# EAGLE design Test (EAGLE 9.2.2)
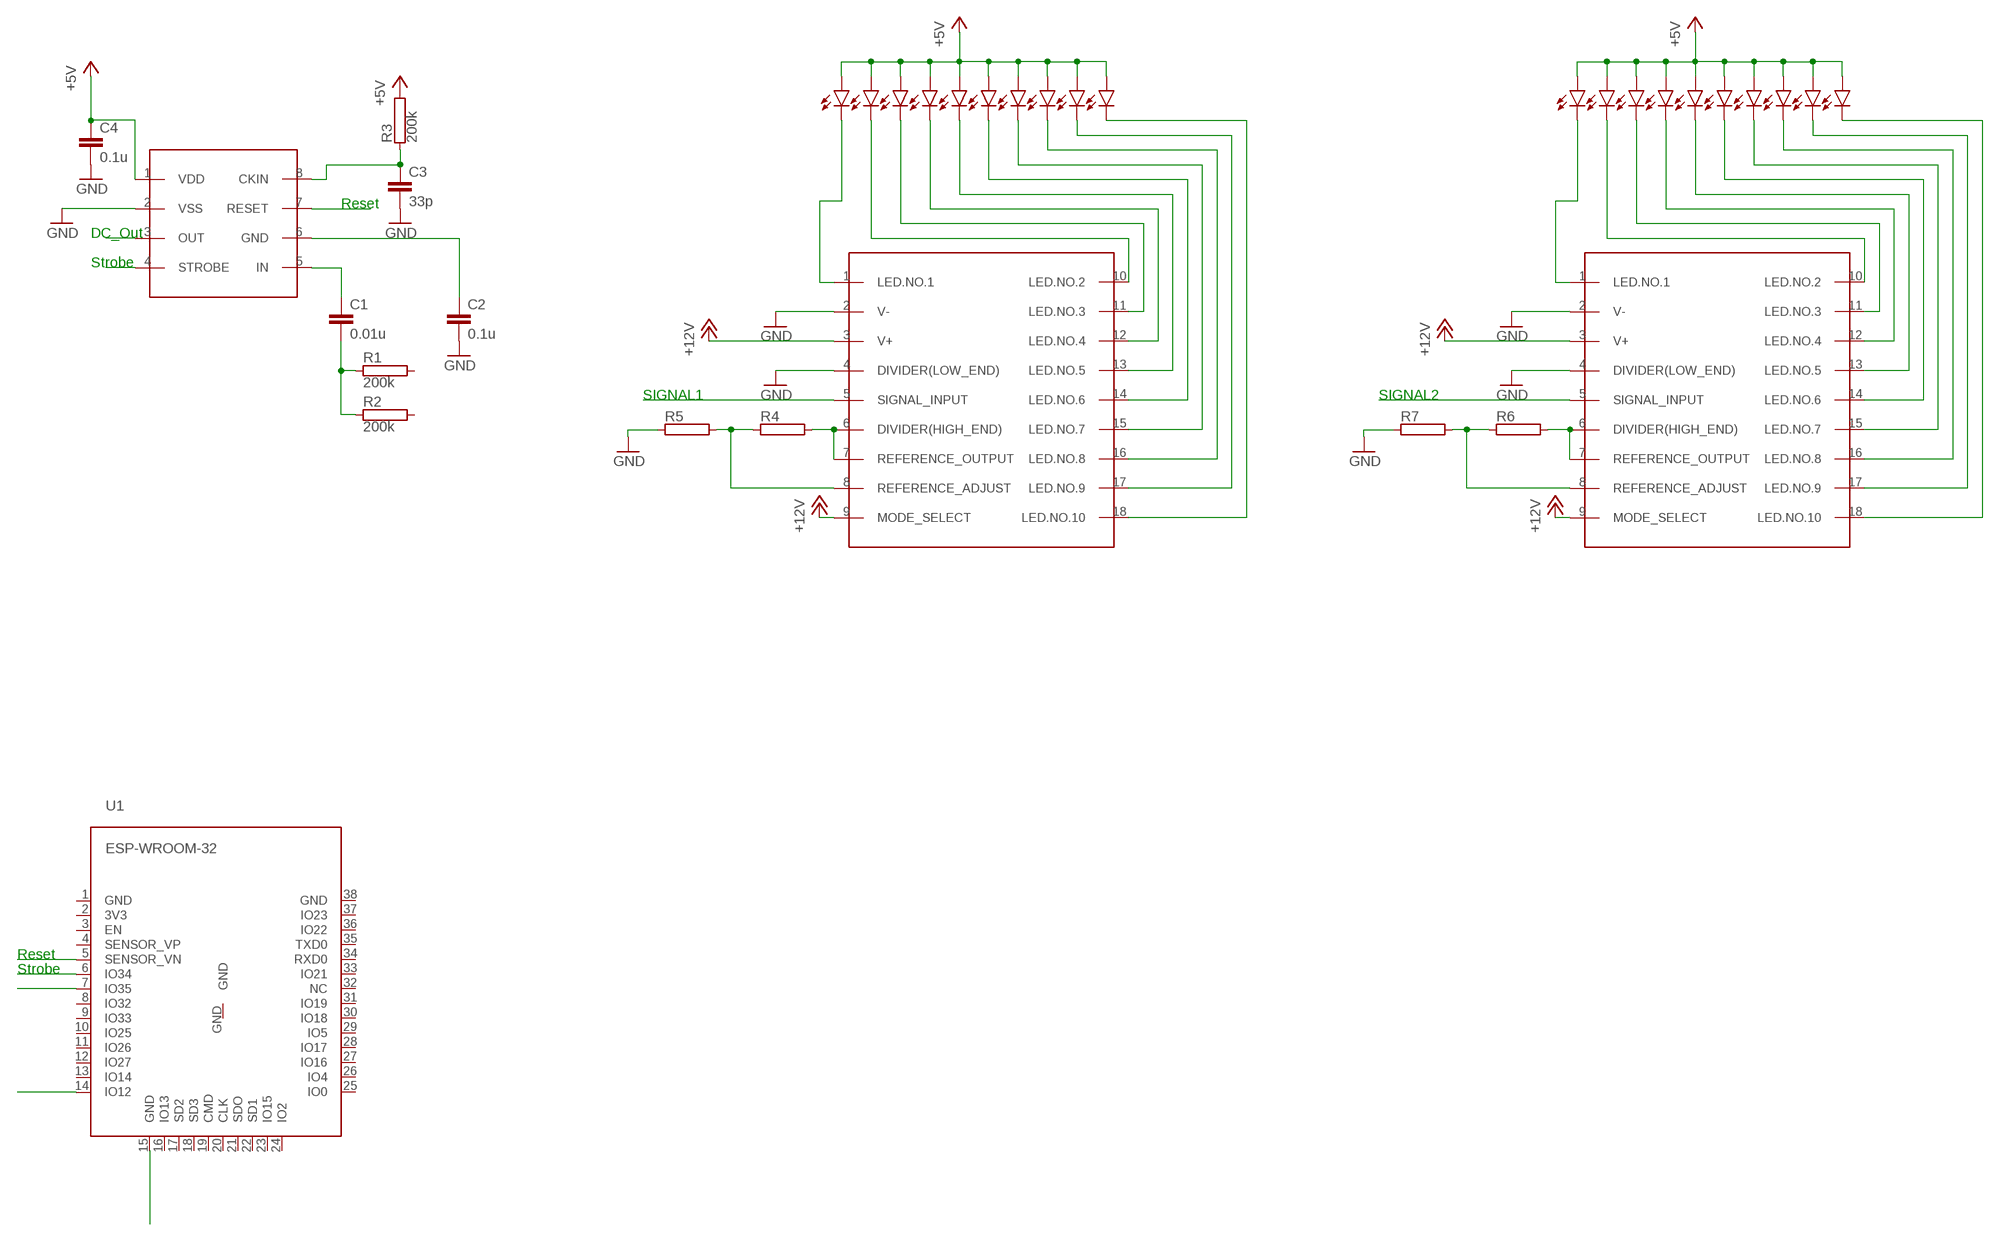
[diagram p0: schematic, sheet 1]

## Parts
C1  0.01u  C2.5/2  [C2.5-2]
C2  0.1u  C2.5/2  [C2.5-2]
C3  33p  C2.5/2  [C2.5-2]
C4  0.1u  C2.5/2  [C2.5-2]
R1  200k  RAC01  [AC01]
R2  200k  RAC01  [AC01]
R3  200k  RAC01  [AC01]
R4  RAC01  [AC01]
R5  RAC01  [AC01]
R6  RAC01  [AC01]
R7  RAC01  [AC01]
U1  ESP-WROOM-32  [ESP-WROOM-32]
U$1  MSGEQ7  [DIL08]
U$2  LB10  [LB10]
U$3  LM3914  [DIL18]
U$4  LB10  [LB10]
U$5  LM3914  [DIL18]

## Nets
+5V: C4.1 R3.2 U$1.1(VDD) U$2.1(A) U$2.2(A1) U$2.3(A2) U$2.4(A3) U$2.5(A4) U$2.6(A5) U$2.7(A6) U$2.8(A7) U$2.9(A8) U$2.10(A9) U$4.1(A) U$4.2(A1) U$4.3(A2) U$4.4(A3) U$4.5(A4) U$4.6(A5) U$4.7(A6) U$4.8(A7) U$4.9(A8) U$4.10(A9)
+12V: U$3.3(V+) U$3.9(MODE_SELECT) U$5.3(V+) U$5.9(MODE_SELECT)
GND: C2.2 C3.2 C4.2 R5.1 R7.1 U$1.2(VSS) U$3.2(V-) U$3.4(DIVIDER(LOW_END)) U$5.2(V-) U$5.4(DIVIDER(LOW_END))
N$1: C2.1 U$1.6(GND)
N$2: C3.1 R3.1 U$1.8(CKIN)
N$3: C1.2 R1.1 R2.1
N$4: C1.1 U$1.5(IN)
N$5: U$1.3(OUT)
N$7: U$1.4(STROBE)
N$8: U$1.7(RESET)
N$9: U$2.11(C) U$3.1(LED.NO.1)
N$10: U$2.12(C1) U$3.10(LED.NO.2)
N$11: U$2.13(C2) U$3.11(LED.NO.3)
N$12: U$2.14(C3) U$3.12(LED.NO.4)
N$13: U$2.15(C4) U$3.13(LED.NO.5)
N$14: U$2.16(C5) U$3.14(LED.NO.6)
N$15: U$2.17(C6) U$3.15(LED.NO.7)
N$16: U$2.18(C7) U$3.16(LED.NO.8)
N$17: U$2.19(C8) U$3.17(LED.NO.9)
N$18: U$2.20(C9) U$3.18(LED.NO.10)
N$19: R4.1 R5.2 U$3.8(REFERENCE_ADJUST)
N$20: U$4.11(C) U$5.1(LED.NO.1)
N$21: U$3.5(SIGNAL_INPUT)
N$22: R4.2 U$3.6(DIVIDER(HIGH_END)) U$3.7(REFERENCE_OUTPUT)
N$23: U$4.12(C1) U$5.10(LED.NO.2)
N$24: U$4.13(C2) U$5.11(LED.NO.3)
N$25: U$4.14(C3) U$5.12(LED.NO.4)
N$26: U$4.15(C4) U$5.13(LED.NO.5)
N$27: U$4.16(C5) U$5.14(LED.NO.6)
N$28: U$4.17(C6) U$5.15(LED.NO.7)
N$29: U$4.18(C7) U$5.16(LED.NO.8)
N$30: U$4.19(C8) U$5.17(LED.NO.9)
N$31: U$4.20(C9) U$5.18(LED.NO.10)
N$32: U$5.5(SIGNAL_INPUT)
N$33: R6.2 U$5.6(DIVIDER(HIGH_END)) U$5.7(REFERENCE_OUTPUT)
N$34: R6.1 R7.2 U$5.8(REFERENCE_ADJUST)
N$35: U1.5(SENSOR_VN)
N$36: U1.6(IO34)
N$37: U1.7(IO35)
N$38: U1.14(IO12)
N$39: U1.15(GND)
Unconnected: R1.2 R2.2 U1.1(GND) U1.2(3V3) U1.3(EN) U1.4(SENSOR_VP) U1.8(IO32) U1.9(IO33) U1.10(IO25) U1.11(IO26) U1.12(IO27) U1.13(IO14) U1.16(IO13) U1.17(SD2) U1.18(SD3) U1.19(CMD) U1.20(CLK) U1.21(SDO) U1.22(SD1) U1.23(IO15) U1.24(IO2) U1.25(IO0) U1.26(IO4) U1.27(IO16) U1.28(IO17) U1.29(IO5) U1.30(IO18) U1.31(IO19) U1.32(NC) U1.33(IO21) U1.34(RXD0) U1.35(TXD0) U1.36(IO22) U1.37(IO23) U1.38(GND) U1.GND

## Notes on the sheet
- Reset
- DC_Out
- Strobe
- SIGNAL1 | SIGNAL2
- Reset
- Strobe

## Library data of the parts
C1-C4 = capacitor-wima:C: CAPACITOR naming: grid - package width
R1-R7 = resistor-power:R: Power Resitor; OC_FARNELL: unknown; OC_NEWARK: unknown
U1 = SpectralAnalyzer:ESP-WROOM-32
U$1 = SpectralAnalyzer:MSGEQ7: Seven Band Graphic Equalizer
U$2 U$4 = SpectralAnalyzer:LB10: Bar LED
U$3 U$5 = SpectralAnalyzer:LM3914: Dot/Bar Display Driver

## Net classes
0 default: width 1.27 mm, clearance 0.381 mm

## Board
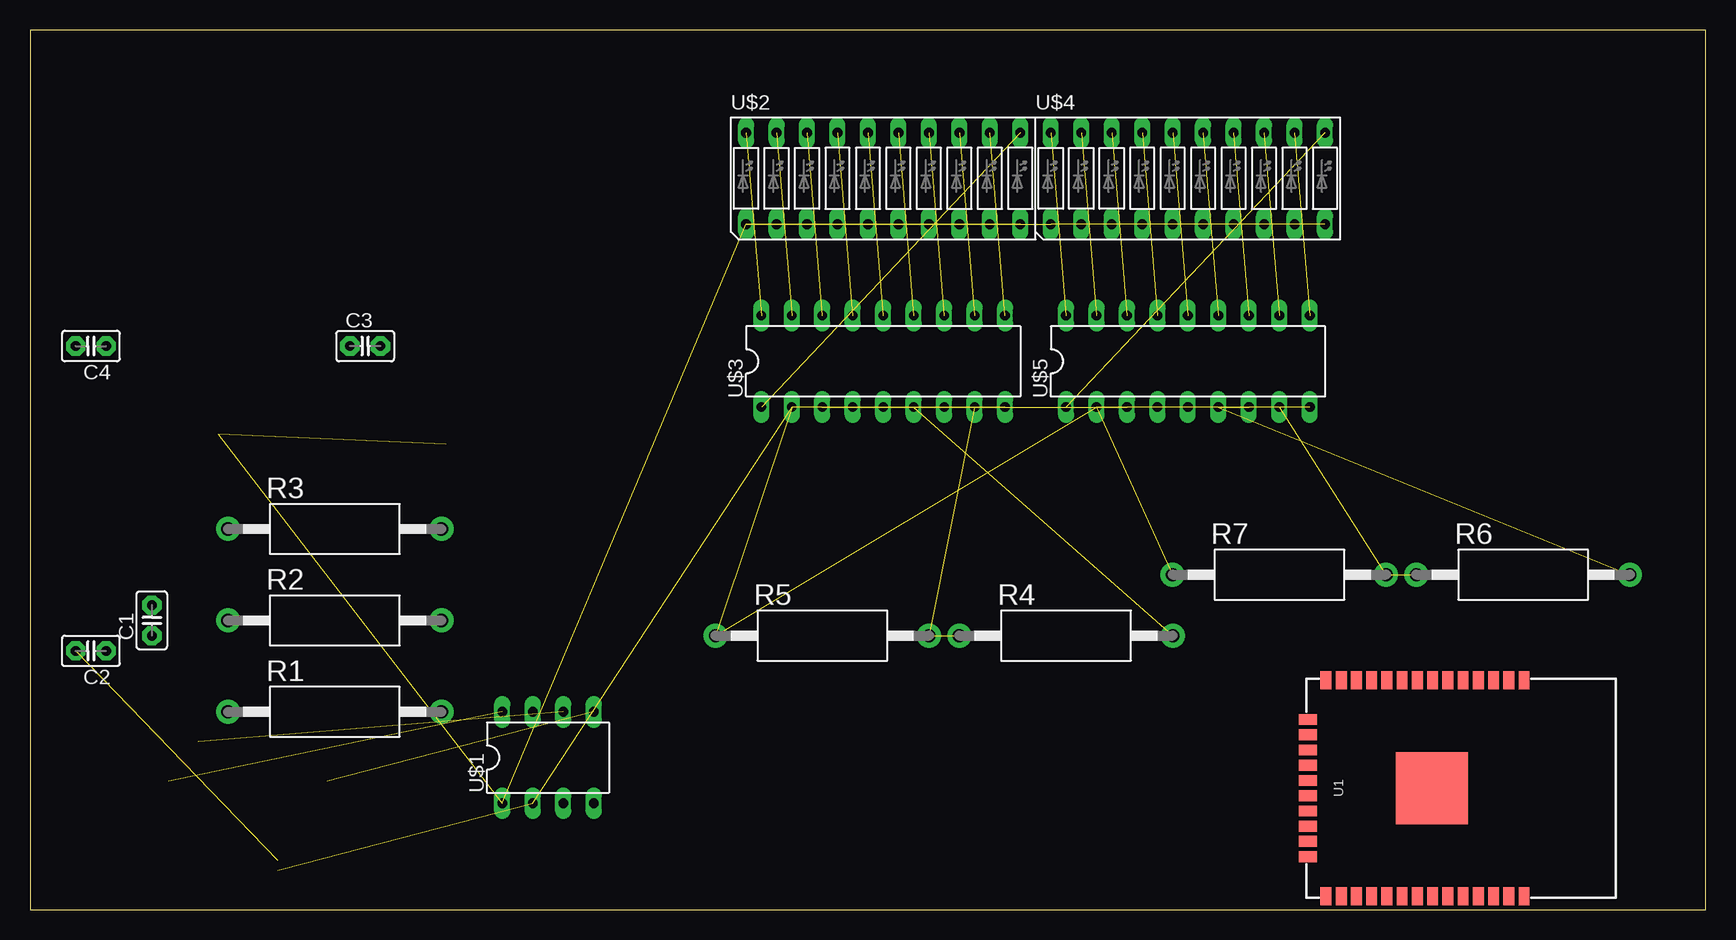
[diagram p1: board, top side]
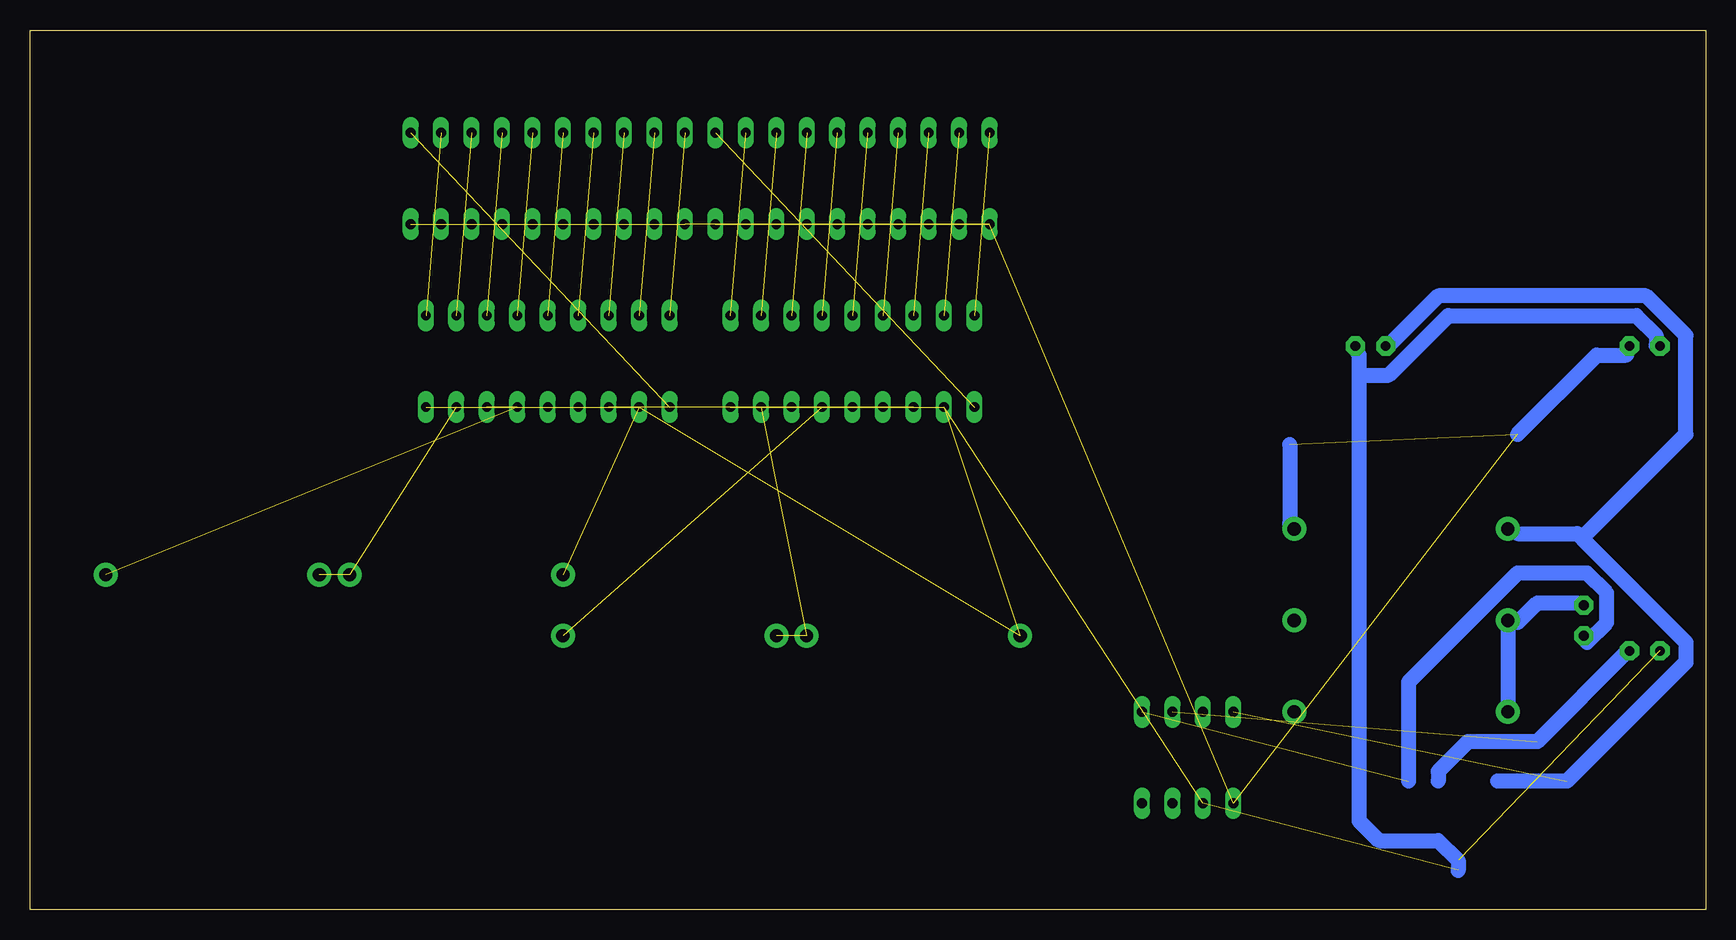
[diagram p2: board, bottom side, seen from below]

Size 139.68 x 73.33 mm. Coordinates in mm from the lower left corner, seen from the top.
Outline: 0,0 139.68,0 139.68,73.33 0,73.33 0,0
Copper layers (1*16): Top 0.035mm / dielectric 1.5mm / Bottom 0.035mm
Design rules "default": minimum track width 6mil, minimum drill 0.35mm, track to track 6mil, track to pad 6mil, pad to pad 6mil, via to via 6mil, smd to smd 6mil, copper to edge 40mil, drill to drill 6mil, minimum pad ring 10mil, minimum via ring 8mil, stop-mask expansion 4mil, vias tented up to drill 0mil, thermal gap 10mil

### Footprints (pad centres in the part's own frame; a part is rotated, then mirrored left to right if it is on the bottom)
C2.5-2 = drill 0.813 pad 1.6 octagon: 1 -1.27,0; 2 1.27,0
AC01 = drill 1.1 pad 2: 1 -8.9,0; 2 8.9,0
ESP-WROOM-32 = smd 0.9 x 1.5: 1 7.7,9; 2 6.43,9; 3 5.16,9; 4 3.89,9; 5 2.62,9; 6 1.35,9; 7 0.08,9; 8 -1.19,9; 9 -2.46,9; 10 -3.73,9; 11 -5,9; 12 -6.27,9; 13 -7.54,9; 14 -8.81,9; 25 -8.81,-9; 26 -7.54,-9; 27 -6.27,-9; 28 -5,-9; 29 -3.73,-9; 30 -2.46,-9; 31 -1.19,-9; 32 0.08,-9; 33 1.35,-9; 34 2.62,-9; 35 3.89,-9; 36 5.16,-9; 37 6.43,-9; 38 7.7,-9 | smd 1.5 x 0.9: 15 -10.3,5.715; 16 -10.3,4.445; 17 -10.3,3.175; 18 -10.3,1.905; 19 -10.3,0.635; 20 -10.3,-0.635; 21 -10.3,-1.905; 22 -10.3,-3.175; 23 -10.3,-4.445; 24 -10.3,-5.715 | smd 6 x 6: GND 0,0
DIL08 = drill 0.813 long: 1 -3.81,-3.81; 2 -1.27,-3.81; 3 1.27,-3.81; 4 3.81,-3.81; 5 3.81,3.81; 6 1.27,3.81; 7 -1.27,3.81; 8 -3.81,3.81
LB10 = drill 0.813 long: 1 -11.43,-3.81; 2 -8.89,-3.81; 3 -6.35,-3.81; 4 -3.81,-3.81; 5 -1.27,-3.81; 6 1.27,-3.81; 7 3.81,-3.81; 8 6.35,-3.81; 9 8.89,-3.81; 10 11.43,-3.81; 11 11.43,3.81; 12 8.89,3.81; 13 6.35,3.81; 14 3.81,3.81; 15 1.27,3.81; 16 -1.27,3.81; 17 -3.81,3.81; 18 -6.35,3.81; 19 -8.89,3.81; 20 -11.43,3.81
DIL18 = drill 0.813 long: 1 -10.16,-3.81; 2 -7.62,-3.81; 3 -5.08,-3.81; 4 -2.54,-3.81; 5 0,-3.81; 6 2.54,-3.81; 7 5.08,-3.81; 8 7.62,-3.81; 9 10.16,-3.81; 10 10.16,3.81; 11 7.62,3.81; 12 5.08,3.81; 13 2.54,3.81; 14 0,3.81; 15 -2.54,3.81; 16 -5.08,3.81; 17 -7.62,3.81; 18 -10.16,3.81

### Placement (x,y rotation side)
C1  10.16,24.13 90 top
C2  5.08,21.59 180 top
C3  27.94,46.99 0 top
C4  5.08,46.99 180 top
R1  25.4,16.51 0 top
R2  25.4,24.13 0 top
R3  25.4,31.75 0 top
R4  86.36,22.86 0 top
R5  66.04,22.86 0 top
R6  124.46,27.94 0 top
R7  104.14,27.94 0 top
U1  116.84,10.16 0 top
U$1  43.18,12.7 0 top
U$2  71.12,60.96 0 top
U$3  71.12,45.72 0 top
U$4  96.52,60.96 0 top
U$5  96.52,45.72 0 top

### Tracks (layer width: path | path; a pad name or v marks a point on that pad's centre or on a via)
+5V  (22 unrouted)
  Bottom 1.27: 34.67,38.8 34.67,32.19 R3.2 | 15.68,39.62 9.08,46.23 6.6,46.23 C4.1
+12V  (3 unrouted)
GND  (8 unrouted)
  Bottom 1.27: 20.64,3.3 20.64,4.13 22.29,5.78 27.24,5.78 28.89,7.43 28.89,44.58 | 28.89,44.58 28.89,46.23 C3.2 | 28.89,44.58 26.42,44.58 21.46,49.53 5.78,49.53 4.13,47.88 4.13,47.05 C4.2
N$1  (1 unrouted)
  Bottom 1.27: 22.29,10.73 22.29,11.56 19.81,14.03 14.03,14.03 6.6,21.46 C2.1
N$2  (1 unrouted)
  Bottom 1.27: 17.34,10.73 11.56,10.73 1.65,20.64 1.65,22.29 10.32,30.96 | 10.32,30.96 10.73,31.37 15.68,31.37 R3.1 | 10.32,30.96 1.65,39.62 1.65,47.88 4.95,51.18 22.29,51.18 26.42,47.05 C3.1
N$3
  Bottom 1.27: C1.2 10.73,25.59 14.03,25.59 15.68,23.94 R2.1 16.51,23.94 R1.1
N$4  (1 unrouted)
  Bottom 1.27: 24.77,10.73 24.77,18.99 15.68,28.07 9.91,28.07 8.26,26.42 8.26,23.94 9.91,22.29 C1.1
N$9  (1 unrouted)
N$10  (1 unrouted)
N$11  (1 unrouted)
N$12  (1 unrouted)
N$13  (1 unrouted)
N$14  (1 unrouted)
N$15  (1 unrouted)
N$16  (1 unrouted)
N$17  (1 unrouted)
N$18  (1 unrouted)
N$19  (2 unrouted)
N$20  (1 unrouted)
N$22  (2 unrouted)
N$23  (1 unrouted)
N$24  (1 unrouted)
N$25  (1 unrouted)
N$26  (1 unrouted)
N$27  (1 unrouted)
N$28  (1 unrouted)
N$29  (1 unrouted)
N$30  (1 unrouted)
N$31  (1 unrouted)
N$33  (2 unrouted)
N$34  (2 unrouted)